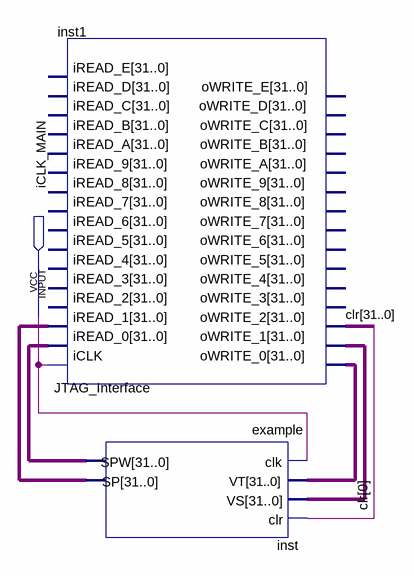
[diagram p0: schematic sheet]
// Quartus schematic MyDesign.bdf as structural Verilog: 2 symbols, 1 pins
module MyDesign (
  input  iCLK_MAIN
);

  wire [31:0] clr, inst1_owrite_0, inst1_owrite_1, inst_sp, inst_spw;

  JTAG_Interface inst1 (
    .iCLK(iCLK_MAIN), .iREAD_0(inst_spw), .iREAD_1(inst_sp), .oWRITE_0(inst1_owrite_0),
    .oWRITE_1(inst1_owrite_1), .oWRITE_2(clr));  // open: iREAD_2, iREAD_3, iREAD_4, iREAD_5, iREAD_6, iREAD_7, iREAD_8, iREAD_9, iREAD_A, iREAD_B, iREAD_C, iREAD_D, iREAD_E, oWRITE_3, oWRITE_4, oWRITE_5, oWRITE_6, oWRITE_7, oWRITE_8, oWRITE_9, oWRITE_A, oWRITE_B, oWRITE_C, oWRITE_D, oWRITE_E
  example inst (.clk(iCLK_MAIN), .VT(inst1_owrite_0), .VS(inst1_owrite_1), .clr(clr[0]), .SPW(inst_spw), .SP(inst_sp));
endmodule
